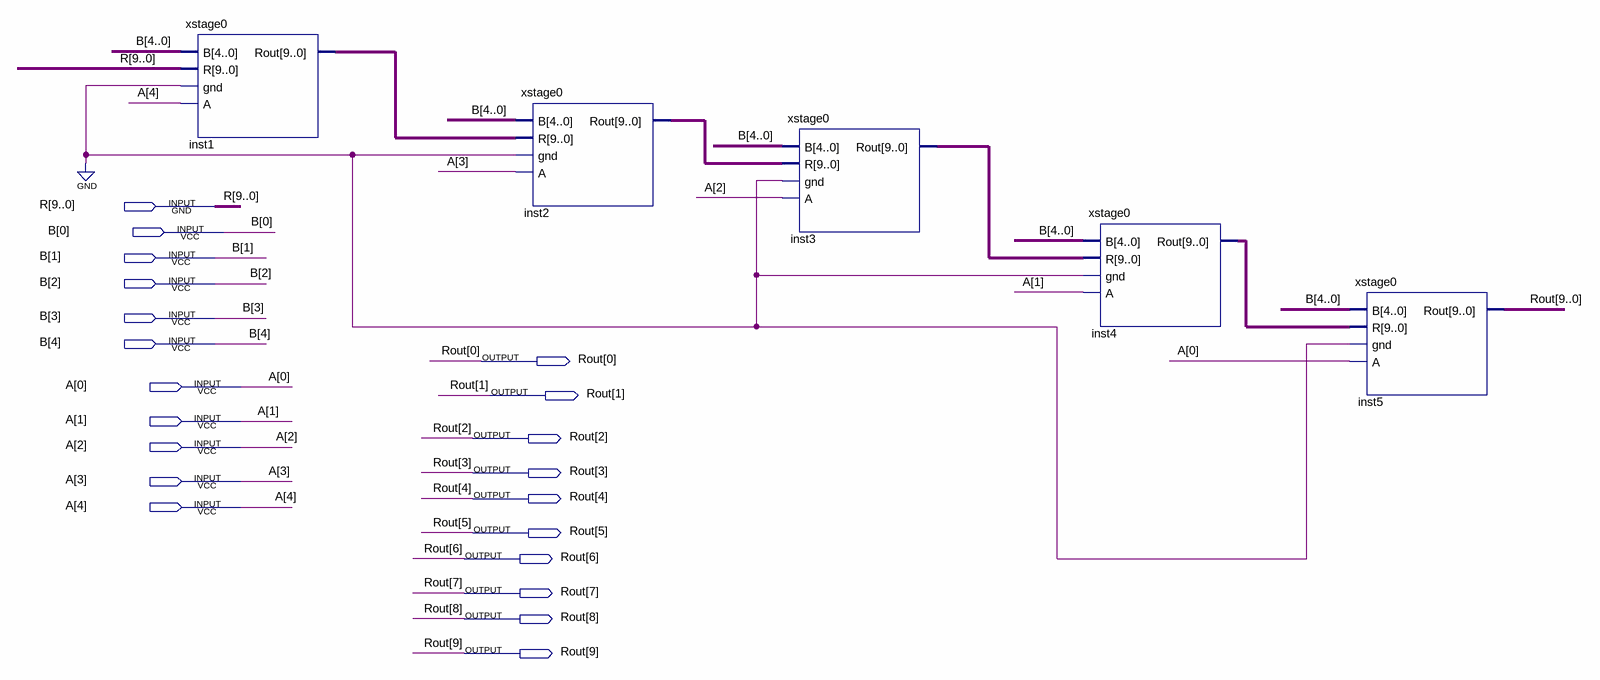
[diagram p0: schematic sheet]
// Quartus schematic xstage1.bdf as structural Verilog: 5 symbols, 21 pins
module xstage1 (
  input  [9:0] R,
  input  [4:0] B,
  input  [4:0] A,
  output [9:0] Rout
);

  wire [9:0] inst1_rout, inst2_rout, inst3_rout, inst4_rout;

  xstage0 inst1 (.B(B), .R(R), .gnd(1'b0), .A(A[4]), .Rout(inst1_rout));
  xstage0 inst2 (.B(B), .R(inst1_rout), .gnd(1'b0), .A(A[3]), .Rout(inst2_rout));
  xstage0 inst3 (.B(B), .R(inst2_rout), .gnd(1'b0), .A(A[2]), .Rout(inst3_rout));
  xstage0 inst4 (.B(B), .R(inst3_rout), .gnd(1'b0), .A(A[1]), .Rout(inst4_rout));
  xstage0 inst5 (.B(B), .R(inst4_rout), .gnd(1'b0), .A(A[0]), .Rout(Rout));
endmodule
